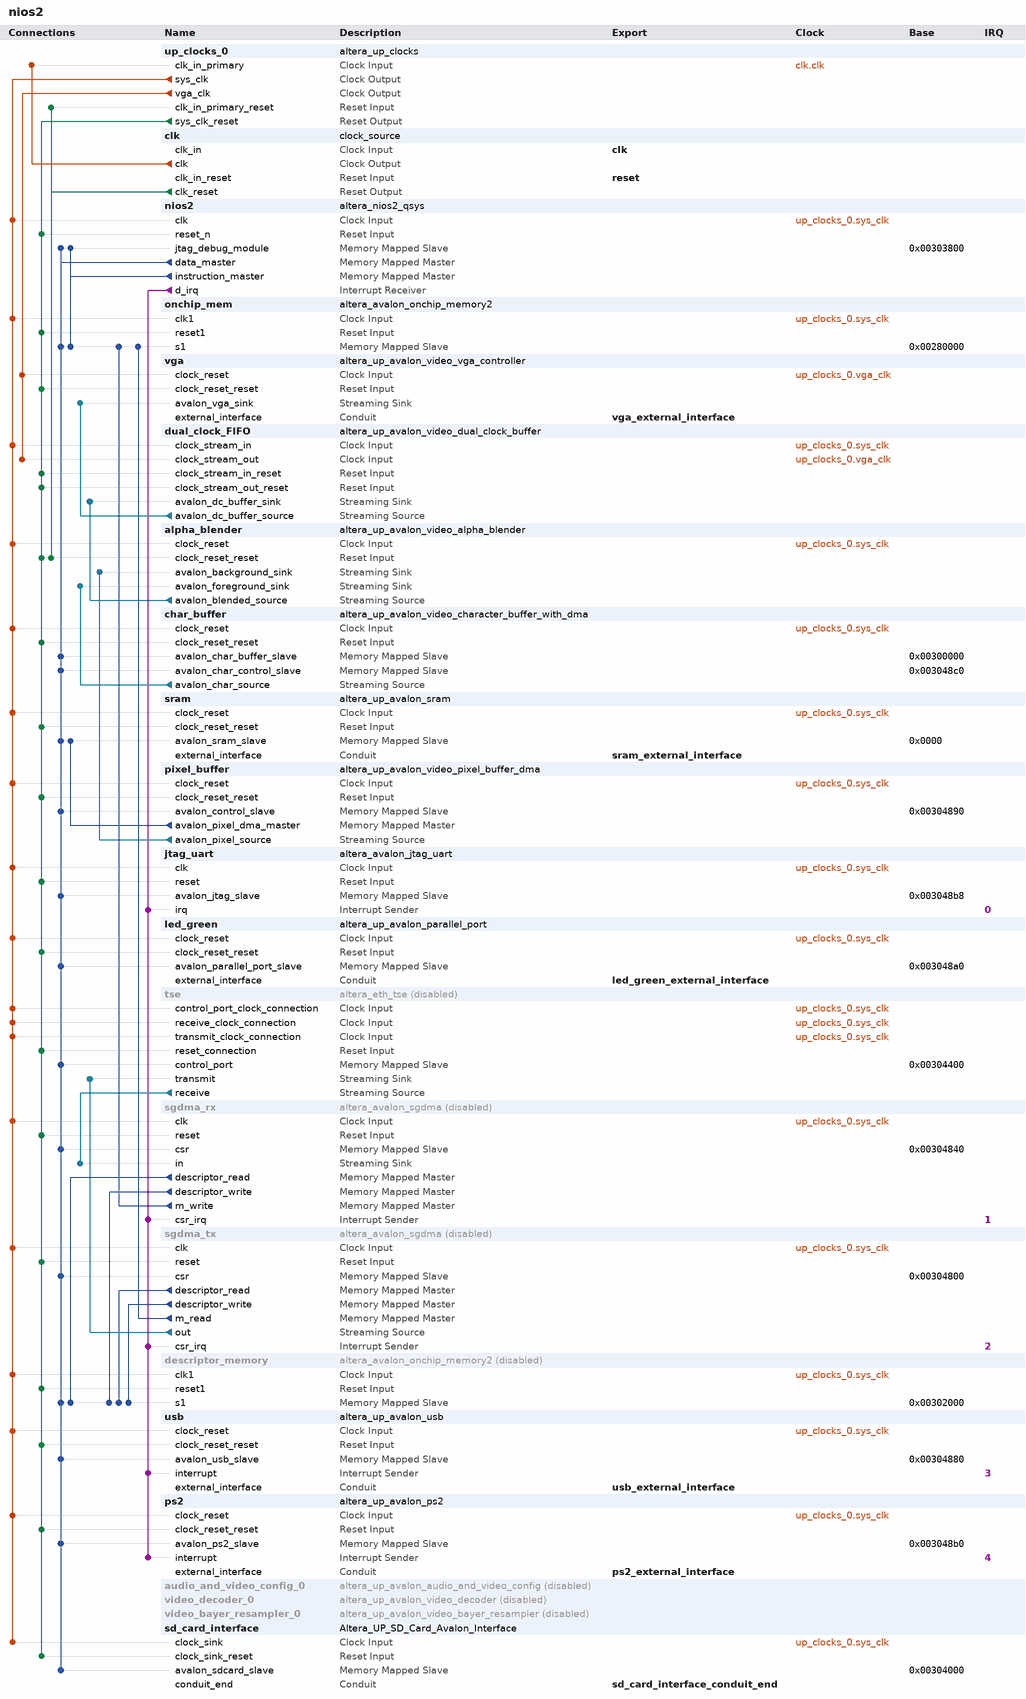
[diagram p0: system contents]
# Platform Designer (Qsys) system nios2, Cyclone IV E EP4CE115F29C7
# Parameters at their usual value, and those the tool derives, are not listed.
package require -exact qsys 13.0
create_system nios2
set_project_property DEVICE_FAMILY {Cyclone IV E}
set_project_property DEVICE EP4CE115F29C7

add_instance up_clocks_0 altera_up_clocks 13.0
set_instance_parameter_value up_clocks_0 board DE2-115
set_instance_parameter_value up_clocks_0 sdram_clk false
set_instance_parameter_value up_clocks_0 vga_clk true
set_instance_parameter_value up_clocks_0 audio_clk false
set_instance_parameter_value up_clocks_0 audio_clk_freq 12.288

add_instance clk clock_source 13.0
set_instance_parameter_value clk clockFrequency 50000000

add_instance nios2 altera_nios2_qsys 13.0
set_instance_parameter_value nios2 resetSlave onchip_mem.s1
set_instance_parameter_value nios2 mmu_TLBMissExcSlave None
set_instance_parameter_value nios2 exceptionSlave onchip_mem.s1
set_instance_parameter_value nios2 breakSlave nios2.jtag_debug_module
set_instance_parameter_value nios2 impl Small
set_instance_parameter_value nios2 icache_size 4096

add_instance onchip_mem altera_avalon_onchip_memory2 13.0.1.99.2
set_instance_parameter_value onchip_mem dataWidth 32
set_instance_parameter_value onchip_mem dualPort false
set_instance_parameter_value onchip_mem initMemContent true
set_instance_parameter_value onchip_mem initializationFileName onchip_mem.hex
set_instance_parameter_value onchip_mem memorySize 307200

add_instance vga altera_up_avalon_video_vga_controller 13.0
set_instance_parameter_value vga board DE2-115

add_instance dual_clock_FIFO altera_up_avalon_video_dual_clock_buffer 13.0
set_instance_parameter_value dual_clock_FIFO color_bits 10

add_instance alpha_blender altera_up_avalon_video_alpha_blender 13.0
set_instance_parameter_value alpha_blender mode Normal

add_instance char_buffer altera_up_avalon_video_character_buffer_with_dma 13.0
set_instance_parameter_value char_buffer enable_transparency true

add_instance sram altera_up_avalon_sram 13.0
set_instance_parameter_value sram board DE2-115
set_instance_parameter_value sram pixel_buffer true

add_instance pixel_buffer altera_up_avalon_video_pixel_buffer_dma 13.0
set_instance_parameter_value pixel_buffer addr_mode X-Y
set_instance_parameter_value pixel_buffer start_address 0
set_instance_parameter_value pixel_buffer back_start_address 0
set_instance_parameter_value pixel_buffer image_width 640
set_instance_parameter_value pixel_buffer image_height 480
set_instance_parameter_value pixel_buffer color_space {30-bit RGB}

add_instance jtag_uart altera_avalon_jtag_uart 13.0.1.99.2
set_instance_parameter_value jtag_uart simInteractiveOptions NO_INTERACTIVE_WINDOWS

add_instance led_green altera_up_avalon_parallel_port 13.0
set_instance_parameter_value led_green board DE2-115
set_instance_parameter_value led_green preset LEDs
set_instance_parameter_value led_green capture false
set_instance_parameter_value led_green edge Rising
set_instance_parameter_value led_green irq false

add_instance tse altera_eth_tse 13.0
set_instance_property tse ENABLED false
set_instance_parameter_value tse core_variation MAC_ONLY
set_instance_parameter_value tse ifGMII RGMII
set_instance_parameter_value tse transceiver_type NONE
set_instance_parameter_value tse enable_hd_logic true
set_instance_parameter_value tse stat_cnt_ena true
set_instance_parameter_value tse enable_shift16 true
set_instance_parameter_value tse enable_mac_flow_ctrl false
set_instance_parameter_value tse enable_magic_detect false
set_instance_parameter_value tse mdio_clk_div 40
set_instance_parameter_value tse ing_addr 11

add_instance sgdma_rx altera_avalon_sgdma 13.0.1.99.2
set_instance_property sgdma_rx ENABLED false
set_instance_parameter_value sgdma_rx enableBurstTransfers false
set_instance_parameter_value sgdma_rx enableUnalignedTransfers false
set_instance_parameter_value sgdma_rx readBlockDataWidth 32
set_instance_parameter_value sgdma_rx sinkErrorWidth 6
set_instance_parameter_value sgdma_rx sourceErrorWidth 0
set_instance_parameter_value sgdma_rx transferMode STREAM_TO_MEMORY
set_instance_parameter_value sgdma_rx writeBurstcountWidth 4

add_instance sgdma_tx altera_avalon_sgdma 13.0.1.99.2
set_instance_property sgdma_tx ENABLED false
set_instance_parameter_value sgdma_tx enableBurstTransfers false
set_instance_parameter_value sgdma_tx enableUnalignedTransfers false
set_instance_parameter_value sgdma_tx readBlockDataWidth 32
set_instance_parameter_value sgdma_tx sinkErrorWidth 0
set_instance_parameter_value sgdma_tx sourceErrorWidth 1
set_instance_parameter_value sgdma_tx transferMode MEMORY_TO_STREAM
set_instance_parameter_value sgdma_tx writeBurstcountWidth 4

add_instance descriptor_memory altera_avalon_onchip_memory2 13.0.1.99.2
set_instance_property descriptor_memory ENABLED false
set_instance_parameter_value descriptor_memory dataWidth 32
set_instance_parameter_value descriptor_memory dualPort false
set_instance_parameter_value descriptor_memory initMemContent true
set_instance_parameter_value descriptor_memory initializationFileName onchip_mem.hex
set_instance_parameter_value descriptor_memory memorySize 4096

add_instance usb altera_up_avalon_usb 13.0

add_instance ps2 altera_up_avalon_ps2 13.0

add_instance audio_and_video_config_0 altera_up_avalon_audio_and_video_config 13.0
set_instance_property audio_and_video_config_0 ENABLED false
set_instance_parameter_value audio_and_video_config_0 board DE2-115
set_instance_parameter_value audio_and_video_config_0 audio_in {Microphone to ADC}
set_instance_parameter_value audio_and_video_config_0 line_in_bypass false
set_instance_parameter_value audio_and_video_config_0 bit_length 24
set_instance_parameter_value audio_and_video_config_0 sampling_rate {48 kHz}
set_instance_parameter_value audio_and_video_config_0 d5m_resolution {640 x 480}

add_instance video_decoder_0 altera_up_avalon_video_decoder 13.0
set_instance_property video_decoder_0 ENABLED false
set_instance_parameter_value video_decoder_0 video_source {5MP Daughtercard (THDB_D5M)}

add_instance video_bayer_resampler_0 altera_up_avalon_video_bayer_resampler 13.0
set_instance_property video_bayer_resampler_0 ENABLED false
set_instance_parameter_value video_bayer_resampler_0 use_custom_format true
set_instance_parameter_value video_bayer_resampler_0 custom_width_in 2592
set_instance_parameter_value video_bayer_resampler_0 custom_height_in 1944

add_instance sd_card_interface Altera_UP_SD_Card_Avalon_Interface 13.0

# connections
add_connection clk.clk up_clocks_0.clk_in_primary clock
add_connection up_clocks_0.sys_clk alpha_blender.clock_reset clock
add_connection up_clocks_0.sys_clk char_buffer.clock_reset clock
add_connection up_clocks_0.sys_clk descriptor_memory.clk1 clock
add_connection up_clocks_0.sys_clk dual_clock_FIFO.clock_stream_in clock
add_connection up_clocks_0.sys_clk jtag_uart.clk clock
add_connection up_clocks_0.sys_clk led_green.clock_reset clock
add_connection up_clocks_0.sys_clk nios2.clk clock
add_connection up_clocks_0.sys_clk onchip_mem.clk1 clock
add_connection up_clocks_0.sys_clk pixel_buffer.clock_reset clock
add_connection up_clocks_0.sys_clk ps2.clock_reset clock
add_connection up_clocks_0.sys_clk sd_card_interface.clock_sink clock
add_connection up_clocks_0.sys_clk sgdma_rx.clk clock
add_connection up_clocks_0.sys_clk sgdma_tx.clk clock
add_connection up_clocks_0.sys_clk sram.clock_reset clock
add_connection up_clocks_0.sys_clk tse.control_port_clock_connection clock
add_connection up_clocks_0.sys_clk tse.receive_clock_connection clock
add_connection up_clocks_0.sys_clk tse.transmit_clock_connection clock
add_connection up_clocks_0.sys_clk usb.clock_reset clock
add_connection up_clocks_0.vga_clk dual_clock_FIFO.clock_stream_out clock
add_connection up_clocks_0.vga_clk vga.clock_reset clock
add_connection clk.clk_reset alpha_blender.clock_reset_reset reset
add_connection clk.clk_reset up_clocks_0.clk_in_primary_reset reset
add_connection up_clocks_0.sys_clk_reset alpha_blender.clock_reset_reset reset
add_connection up_clocks_0.sys_clk_reset char_buffer.clock_reset_reset reset
add_connection up_clocks_0.sys_clk_reset descriptor_memory.reset1 reset
add_connection up_clocks_0.sys_clk_reset dual_clock_FIFO.clock_stream_in_reset reset
add_connection up_clocks_0.sys_clk_reset dual_clock_FIFO.clock_stream_out_reset reset
add_connection up_clocks_0.sys_clk_reset jtag_uart.reset reset
add_connection up_clocks_0.sys_clk_reset led_green.clock_reset_reset reset
add_connection up_clocks_0.sys_clk_reset nios2.reset_n reset
add_connection up_clocks_0.sys_clk_reset onchip_mem.reset1 reset
add_connection up_clocks_0.sys_clk_reset pixel_buffer.clock_reset_reset reset
add_connection up_clocks_0.sys_clk_reset ps2.clock_reset_reset reset
add_connection up_clocks_0.sys_clk_reset sd_card_interface.clock_sink_reset reset
add_connection up_clocks_0.sys_clk_reset sgdma_rx.reset reset
add_connection up_clocks_0.sys_clk_reset sgdma_tx.reset reset
add_connection up_clocks_0.sys_clk_reset sram.clock_reset_reset reset
add_connection up_clocks_0.sys_clk_reset tse.reset_connection reset
add_connection up_clocks_0.sys_clk_reset usb.clock_reset_reset reset
add_connection up_clocks_0.sys_clk_reset vga.clock_reset_reset reset
add_connection nios2.data_master char_buffer.avalon_char_buffer_slave avalon
set_connection_parameter_value nios2.data_master/char_buffer.avalon_char_buffer_slave baseAddress 0x00300000
add_connection nios2.data_master char_buffer.avalon_char_control_slave avalon
set_connection_parameter_value nios2.data_master/char_buffer.avalon_char_control_slave baseAddress 0x003048c0
add_connection nios2.data_master descriptor_memory.s1 avalon
set_connection_parameter_value nios2.data_master/descriptor_memory.s1 baseAddress 0x00302000
add_connection nios2.data_master jtag_uart.avalon_jtag_slave avalon
set_connection_parameter_value nios2.data_master/jtag_uart.avalon_jtag_slave baseAddress 0x003048b8
add_connection nios2.data_master led_green.avalon_parallel_port_slave avalon
set_connection_parameter_value nios2.data_master/led_green.avalon_parallel_port_slave baseAddress 0x003048a0
add_connection nios2.data_master nios2.jtag_debug_module avalon
set_connection_parameter_value nios2.data_master/nios2.jtag_debug_module baseAddress 0x00303800
add_connection nios2.data_master onchip_mem.s1 avalon
set_connection_parameter_value nios2.data_master/onchip_mem.s1 baseAddress 0x00280000
add_connection nios2.data_master pixel_buffer.avalon_control_slave avalon
set_connection_parameter_value nios2.data_master/pixel_buffer.avalon_control_slave baseAddress 0x00304890
add_connection nios2.data_master ps2.avalon_ps2_slave avalon
set_connection_parameter_value nios2.data_master/ps2.avalon_ps2_slave baseAddress 0x003048b0
add_connection nios2.data_master sd_card_interface.avalon_sdcard_slave avalon
set_connection_parameter_value nios2.data_master/sd_card_interface.avalon_sdcard_slave baseAddress 0x00304000
add_connection nios2.data_master sgdma_rx.csr avalon
set_connection_parameter_value nios2.data_master/sgdma_rx.csr baseAddress 0x00304840
add_connection nios2.data_master sgdma_tx.csr avalon
set_connection_parameter_value nios2.data_master/sgdma_tx.csr baseAddress 0x00304800
add_connection nios2.data_master sram.avalon_sram_slave avalon
set_connection_parameter_value nios2.data_master/sram.avalon_sram_slave baseAddress 0x0000
add_connection nios2.data_master tse.control_port avalon
set_connection_parameter_value nios2.data_master/tse.control_port baseAddress 0x00304400
add_connection nios2.data_master usb.avalon_usb_slave avalon
set_connection_parameter_value nios2.data_master/usb.avalon_usb_slave baseAddress 0x00304880
add_connection nios2.instruction_master nios2.jtag_debug_module avalon
set_connection_parameter_value nios2.instruction_master/nios2.jtag_debug_module baseAddress 0x00303800
add_connection nios2.instruction_master onchip_mem.s1 avalon
set_connection_parameter_value nios2.instruction_master/onchip_mem.s1 baseAddress 0x00280000
add_connection pixel_buffer.avalon_pixel_dma_master sram.avalon_sram_slave avalon
set_connection_parameter_value pixel_buffer.avalon_pixel_dma_master/sram.avalon_sram_slave baseAddress 0x0000
add_connection sgdma_rx.descriptor_read descriptor_memory.s1 avalon
set_connection_parameter_value sgdma_rx.descriptor_read/descriptor_memory.s1 baseAddress 0x00302000
add_connection sgdma_rx.descriptor_write descriptor_memory.s1 avalon
set_connection_parameter_value sgdma_rx.descriptor_write/descriptor_memory.s1 baseAddress 0x00302000
add_connection sgdma_rx.m_write onchip_mem.s1 avalon
set_connection_parameter_value sgdma_rx.m_write/onchip_mem.s1 baseAddress 0x00280000
add_connection sgdma_tx.descriptor_read descriptor_memory.s1 avalon
set_connection_parameter_value sgdma_tx.descriptor_read/descriptor_memory.s1 baseAddress 0x00302000
add_connection sgdma_tx.descriptor_write descriptor_memory.s1 avalon
set_connection_parameter_value sgdma_tx.descriptor_write/descriptor_memory.s1 baseAddress 0x00302000
add_connection sgdma_tx.m_read onchip_mem.s1 avalon
set_connection_parameter_value sgdma_tx.m_read/onchip_mem.s1 baseAddress 0x00280000
add_connection alpha_blender.avalon_blended_source dual_clock_FIFO.avalon_dc_buffer_sink avalon_streaming
add_connection char_buffer.avalon_char_source alpha_blender.avalon_foreground_sink avalon_streaming
add_connection dual_clock_FIFO.avalon_dc_buffer_source vga.avalon_vga_sink avalon_streaming
add_connection pixel_buffer.avalon_pixel_source alpha_blender.avalon_background_sink avalon_streaming
add_connection sgdma_tx.out tse.transmit avalon_streaming
add_connection tse.receive sgdma_rx.in avalon_streaming
add_connection nios2.d_irq jtag_uart.irq interrupt
set_connection_parameter_value nios2.d_irq/jtag_uart.irq irqNumber 0
add_connection nios2.d_irq ps2.interrupt interrupt
set_connection_parameter_value nios2.d_irq/ps2.interrupt irqNumber 4
add_connection nios2.d_irq sgdma_rx.csr_irq interrupt
set_connection_parameter_value nios2.d_irq/sgdma_rx.csr_irq irqNumber 1
add_connection nios2.d_irq sgdma_tx.csr_irq interrupt
set_connection_parameter_value nios2.d_irq/sgdma_tx.csr_irq irqNumber 2
add_connection nios2.d_irq usb.interrupt interrupt
set_connection_parameter_value nios2.d_irq/usb.interrupt irqNumber 3

# exported interfaces
add_interface clk clock sink
set_interface_property clk EXPORT_OF clk.clk_in
add_interface reset reset sink
set_interface_property reset EXPORT_OF clk.clk_in_reset
add_interface vga_external_interface conduit end
set_interface_property vga_external_interface EXPORT_OF vga.external_interface
add_interface led_green_external_interface conduit end
set_interface_property led_green_external_interface EXPORT_OF led_green.external_interface
add_interface sram_external_interface conduit end
set_interface_property sram_external_interface EXPORT_OF sram.external_interface
add_interface usb_external_interface conduit end
set_interface_property usb_external_interface EXPORT_OF usb.external_interface
add_interface ps2_external_interface conduit end
set_interface_property ps2_external_interface EXPORT_OF ps2.external_interface
add_interface sd_card_interface_conduit_end conduit end
set_interface_property sd_card_interface_conduit_end EXPORT_OF sd_card_interface.conduit_end

set_interconnect_requirement {$system} qsys_mm.clockCrossingAdapter HANDSHAKE
set_interconnect_requirement {$system} qsys_mm.maxAdditionalLatency 1

save_system nios2.qsys
